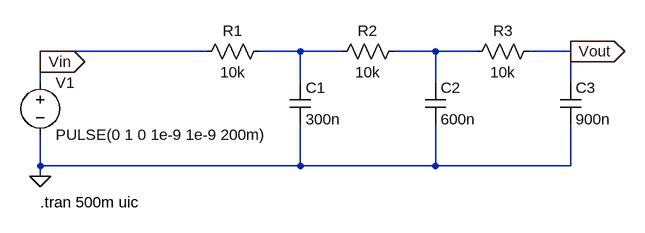
[diagram p0: schematic RC_LINE.asc]
RC_LINE.asc, the LTspice schematic file:
Version 4.1
SHEET 1 880 680
WIRE 160 80 -96 80
WIRE 304 80 240 80
WIRE 368 80 304 80
WIRE 512 80 448 80
WIRE 576 80 512 80
WIRE 720 80 656 80
WIRE -96 96 -96 80
WIRE -96 128 -96 96
WIRE 304 128 304 80
WIRE 512 128 512 80
WIRE 720 128 720 80
WIRE -96 256 -96 208
WIRE 304 256 304 192
WIRE 304 256 -96 256
WIRE 512 256 512 192
WIRE 512 256 304 256
WIRE 720 256 720 192
WIRE 720 256 512 256
WIRE -96 272 -96 256
FLAG -96 272 0
FLAG 720 80 Vout
IOPIN 720 80 Out
FLAG -96 96 Vin
IOPIN -96 96 Out
SYMBOL voltage -96 112 R0
WINDOW 123 0 0 Left 0
WINDOW 39 0 0 Left 0
SYMATTR InstName V1
SYMATTR Value PULSE(0 1 0 1e-9 1e-9 200m)
SYMBOL res 256 64 R90
WINDOW 0 0 56 VBottom 2
WINDOW 3 32 56 VTop 2
SYMATTR InstName R1
SYMATTR Value 10k
SYMBOL res 464 64 R90
WINDOW 0 0 56 VBottom 2
WINDOW 3 32 56 VTop 2
SYMATTR InstName R2
SYMATTR Value 10k
SYMBOL res 672 64 R90
WINDOW 0 0 56 VBottom 2
WINDOW 3 32 56 VTop 2
SYMATTR InstName R3
SYMATTR Value 10k
SYMBOL cap 288 128 R0
SYMATTR InstName C1
SYMATTR Value 300n
SYMBOL cap 496 128 R0
SYMATTR InstName C2
SYMATTR Value 600n
SYMBOL cap 704 128 R0
SYMATTR InstName C3
SYMATTR Value 900n
TEXT -96 312 Left 2 !.tran 500m uic

The netlist it stands for:
* RC_LINE.asc
V1 Vin 0 PULSE(0 1 0 1e-9 1e-9 200m)
R1 N001 Vin 10k
R2 N002 N001 10k
R3 Vout N002 10k
C1 N001 0 300n
C2 N002 0 600n
C3 Vout 0 900n
.tran 500m uic
.backanno
.end